# EAGLE design ALSW_LED (EAGLE 9.1.3)
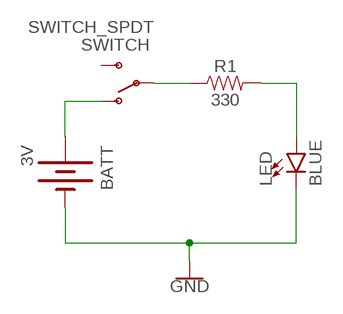
[diagram p0: schematic, sheet 1]

## Parts
BATT  3V  BATTERY24.5MM  [BATTCON_24.5MM]
LED  BLUE  LED-BLUE1206  [LED-1206]
R1  330  0.27OHM-0603-1/10W-1%  [0603]
SWITCH  SWITCH_SPDT  [KPS-1290]

## Nets
GND: BATT.2(-) LED.C
N$1: BATT.1(+) SWITCH.O
N$2: R1.1 SWITCH.P
N$3: LED.A R1.2
Unconnected: SWITCH.S

## Library data of the parts
BATT = SparkFun-Retired:BATTERY: Battery - Single Cell A variety of battery chemistries, sizes, and footprints. Including AA, AAA, 18650 (PRT-12895), 20mm coin cell and 12mm coin cell. 20MM_4LEGS, BATT-10373
LED = SparkFun-LED:LED-BLUE: Blue SMD LED Used in manufacturing of various products at SparkFun Packages: 0603 - SMD 0603 package [Product Link] <http://www.digikey.com/product-detail/en/SMLE12BC7TT86/511-1589-2-ND/1641808> 1206 - SMD1206 package [Product Link] <http://www.digikey.com/product-detail/en/lite-on-inc/LTST-C150TBKT/160-1643-1-ND/573584> SparkFun Products: ESP8266 Thing-Dev Board <https://www.sparkfun.com/products/13711> RedBoard <https://www.sparkfun.com/products/12757>; PROD_ID: DIO-09911
R1 = SparkFun-Resistors:0.27OHM: 0.27Ω resistor A resistor is a passive two-terminal electrical component that implements electrical resistance as a circuit element. Resistors act to reduce current flow, and, at the same time, act to lower voltage levels within circuits. - Wikipedia; PROD_ID: RES-08787; VALUE: 0.27
SWITCH = SparkFun-Retired:SWITCH_SPDT: SWCH-10651 Side-actuated SPDT slide switch, as used on the Arduino Pro; PROD_ID: SWCH-10651

## Board
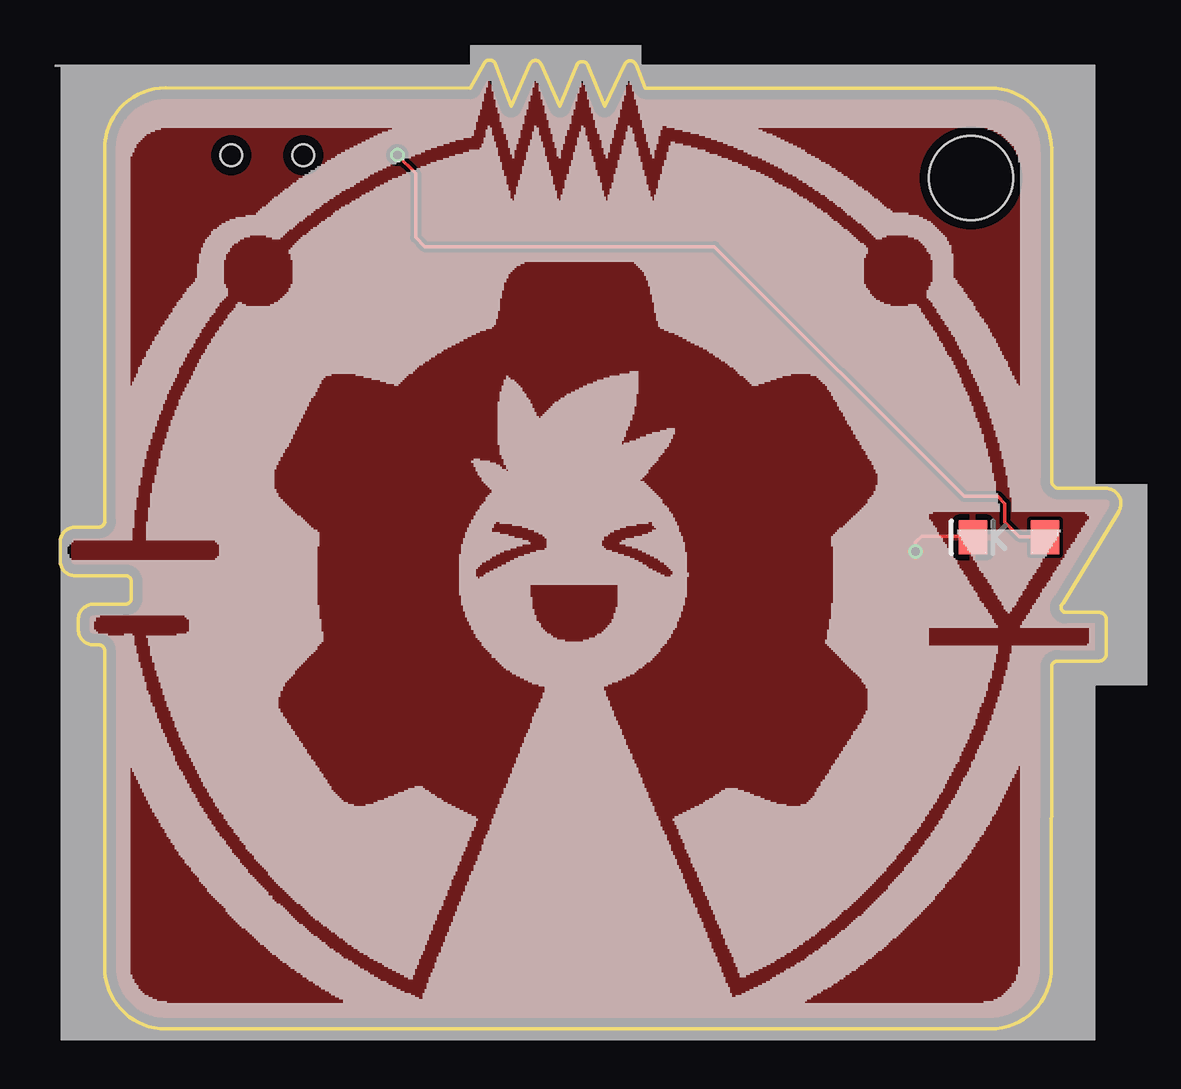
[diagram p1: board, top side]
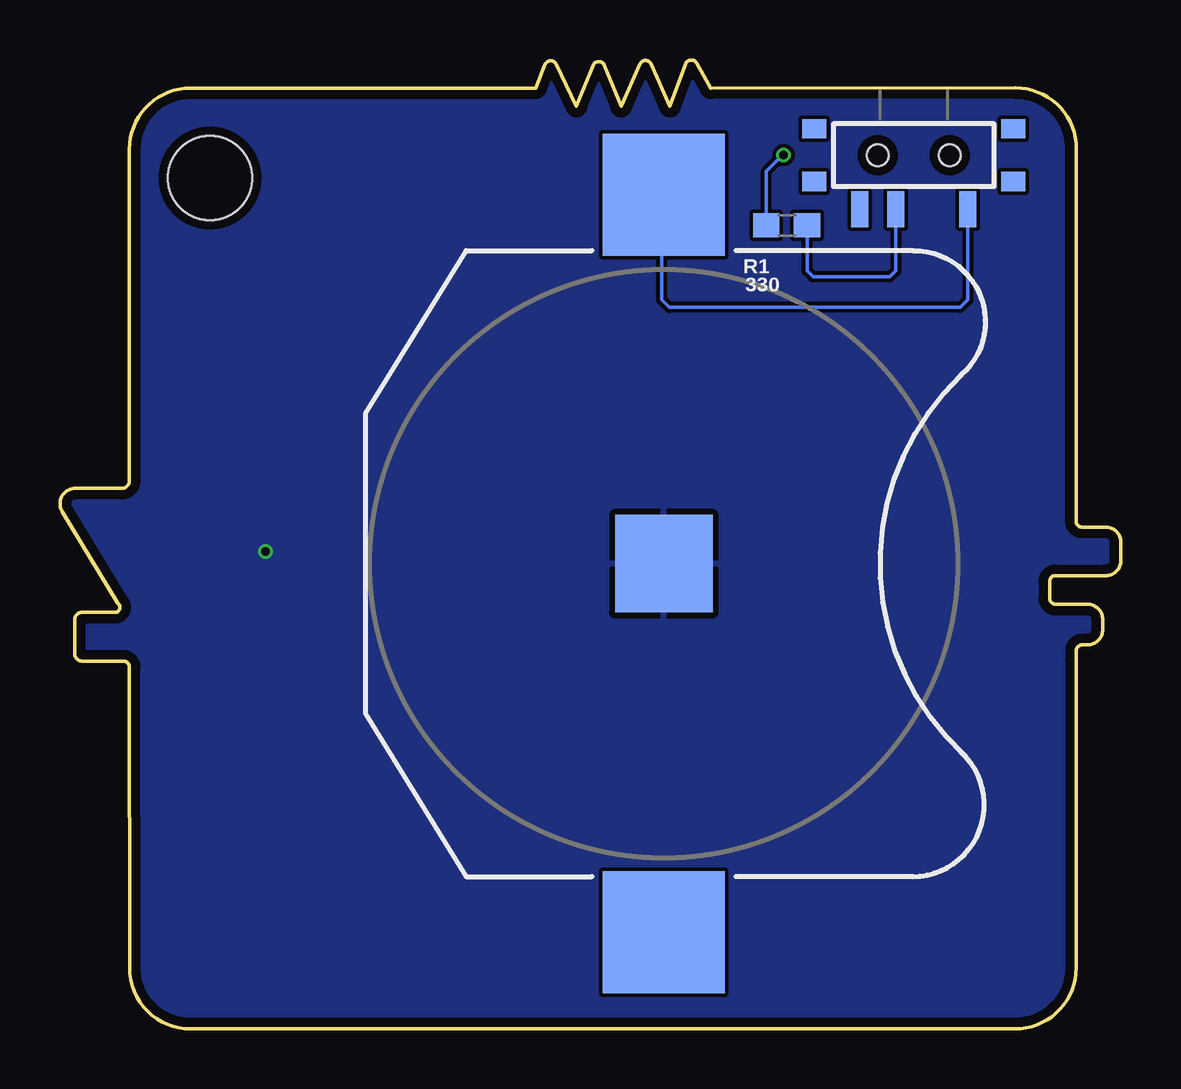
[diagram p2: board, bottom side, seen from below]

Size 44.21 x 40.37 mm. Coordinates in mm from the lower left corner, seen from the top.
Outline: 1.86,15.32 1.86,2.54 arc90 4.4,0 38.77,0 arc90 41.31,2.54 41.31,15.07 arc-90 41.57,15.32 43.28,15.32 arc90 43.6,15.64 43.6,17.04 arc90 43.28,17.35 41.85,17.35 arc-121 41.8,17.74 44.11,21.55 arc121 43.57,22.52 41.63,22.52 arc-90 41.31,22.84 41.31,36.66 arc90 38.77,39.2 24.38,39.2 24,40.18 arc133 23.54,40.19 22.69,38.43 21.99,40.14 arc136 21.52,40.14 20.83,38.43 20.04,40.2 arc132 19.58,40.2 18.79,38.43 18.14,40.2 arc131 17.68,40.24 17.1,39.2 4.4,39.21 arc90 1.85,36.66 1.87,21.16 arc-91 1.61,20.9 0.64,20.91 arc90 0,20.27 0,19.51 arc90 0.64,18.88 2.72,18.89 arc-90 2.97,18.63 2.97,17.94 arc-90 2.72,17.68 1.4,17.69 arc90 0.76,17.06 0.76,16.76 0.76,16.64 arc90 1.4,16 1.61,16 arc-90 1.86,15.75 1.86,15.41
Outline: 1.86,15.41 1.86,15.32
Outline: 1.86,15.32 1.86,15.41
Copper layers (1*16): Top 0.035559375mm / dielectric 1.6mm / Bottom 0.035559375mm
Design rules "oshpark-2layer": minimum track width 6mil, minimum drill 10mil, track to track 6mil, track to pad 6mil, pad to pad 6mil, via to via 6mil, smd to smd 6mil, copper to edge 15mil, drill to drill 6mil, minimum pad ring 5mil, minimum via ring 5mil, stop-mask expansion 2.5mil, vias tented up to drill 0mil, thermal gap 10mil
Holes 3.5 mm at 37.95,35.46

### Footprints (pad centres in the part's own frame; a part is rotated, then mirrored left to right if it is on the bottom)
BATTCON_24.5MM = smd 5.08 x 5.08: 1 -15.367,0; 3 15.367,0 | smd 4.064 x 4.064: 2 0,0
LED-1206 = smd 1.2 x 1.4: A -1.5,0; C 1.5,0
0603 = smd 1.1 x 1: 1 -0.85,0; 2 0.85,0
KPS-1290 = smd 0.7 x 1.5: O -2.25,2.25; P 0.75,2.25; S 2.25,2.25 | smd 1 x 0.8: P$1 -4.15,1.1; P$2 -4.15,-1.1; P$3 4.15,-1.1; P$4 4.15,1.1 | hole 0.9: -1.5,0; 1.5,0

### Placement (x,y rotation side)
BATT  19.05,19.38 270 bottom
LED  39.54,20.48 180 top
R1  13.93,33.49 180 bottom
SWITCH  8.63,36.41 180 bottom

### Tracks (layer width: path | path; a pad name or v marks a point on that pad's centre or on a via)
GND  (via drill 0.35)
  Top 0.152: LED.C 37.99,20.53 35.9,20.53 35.64,20.28 v35.64,19.9
  pour Top: 0.08,-0.42 0.08,41.49 47.07,41.49 47.07,-1.69 45.8,-1.69 0.08,-1.69
  pour Bottom: 0.08,-1.69 0.08,41.49 47.07,41.49 47.07,-1.69 43.26,-1.69
N$1
  Bottom 0.152: SWITCH.O 6.38,30.37 6.7,30.06 18.82,30.06 19.13,30.37 19.13,34.66 arc90 BATT.1
N$2
  Bottom 0.152: SWITCH.P 9.38,31.58 9.64,31.33 12.82,31.33 13.08,31.58 R1.1
N$3  (via drill 0.35)
  Top 0.152: LED.A 41.02,20.51 39.97,20.51 39.37,21.11 39.37,21.88 39.07,22.18 37.68,22.18 27.26,32.6 15.2,32.6 14.82,32.98 14.82,35.64 v14.05,36.41
  Bottom 0.152: v14.05,36.41 14.1,36.41 14.78,35.73 R1.2

### Text on the board
bStop: github.com/alswnet/HelloALSW.git